# Altium project MASTER.PrjPcb (part 1 of 3)
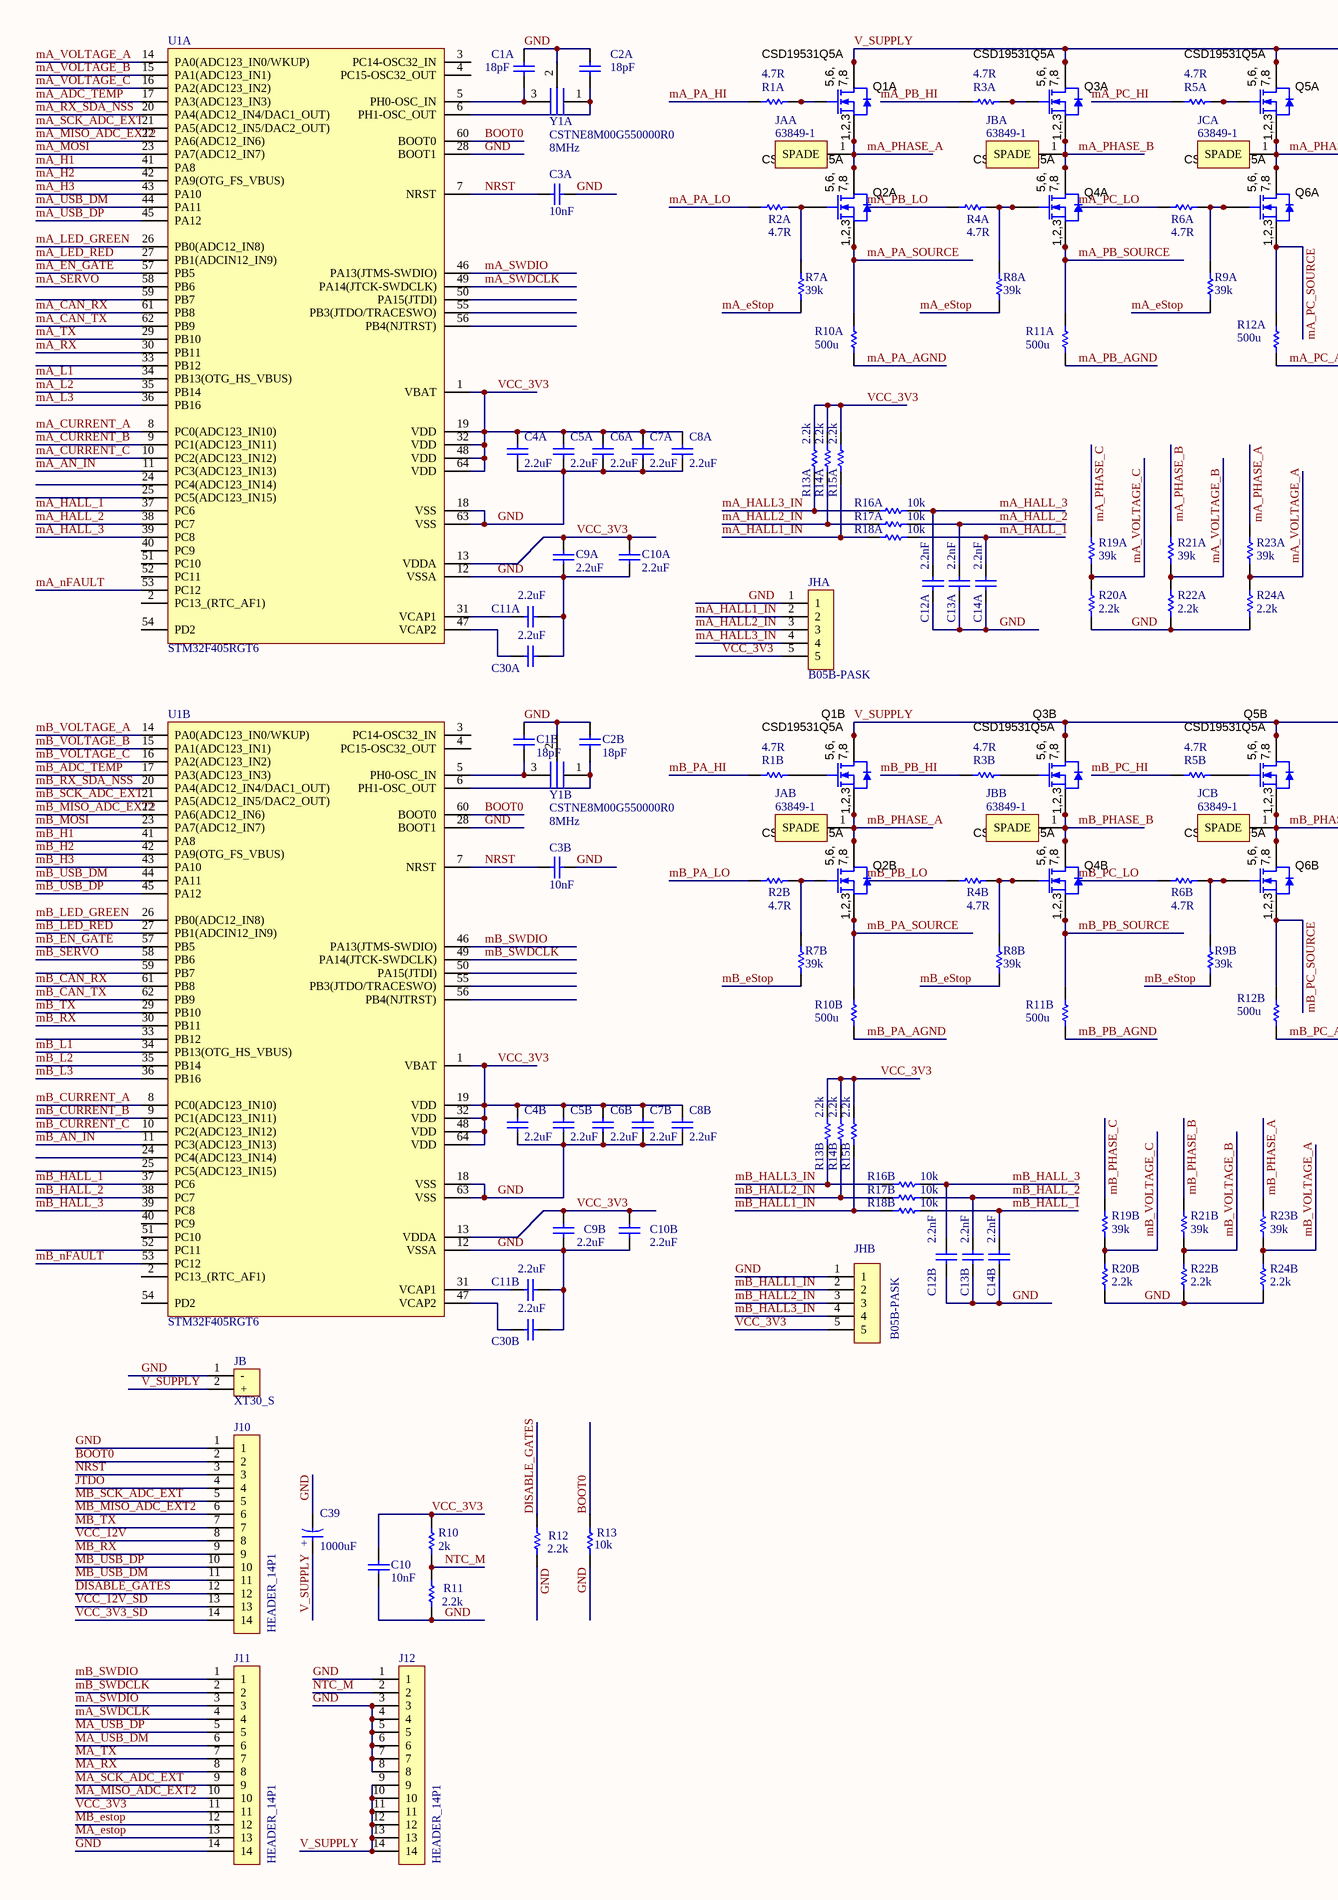
[diagram p0: Vesc.SchDoc, left]
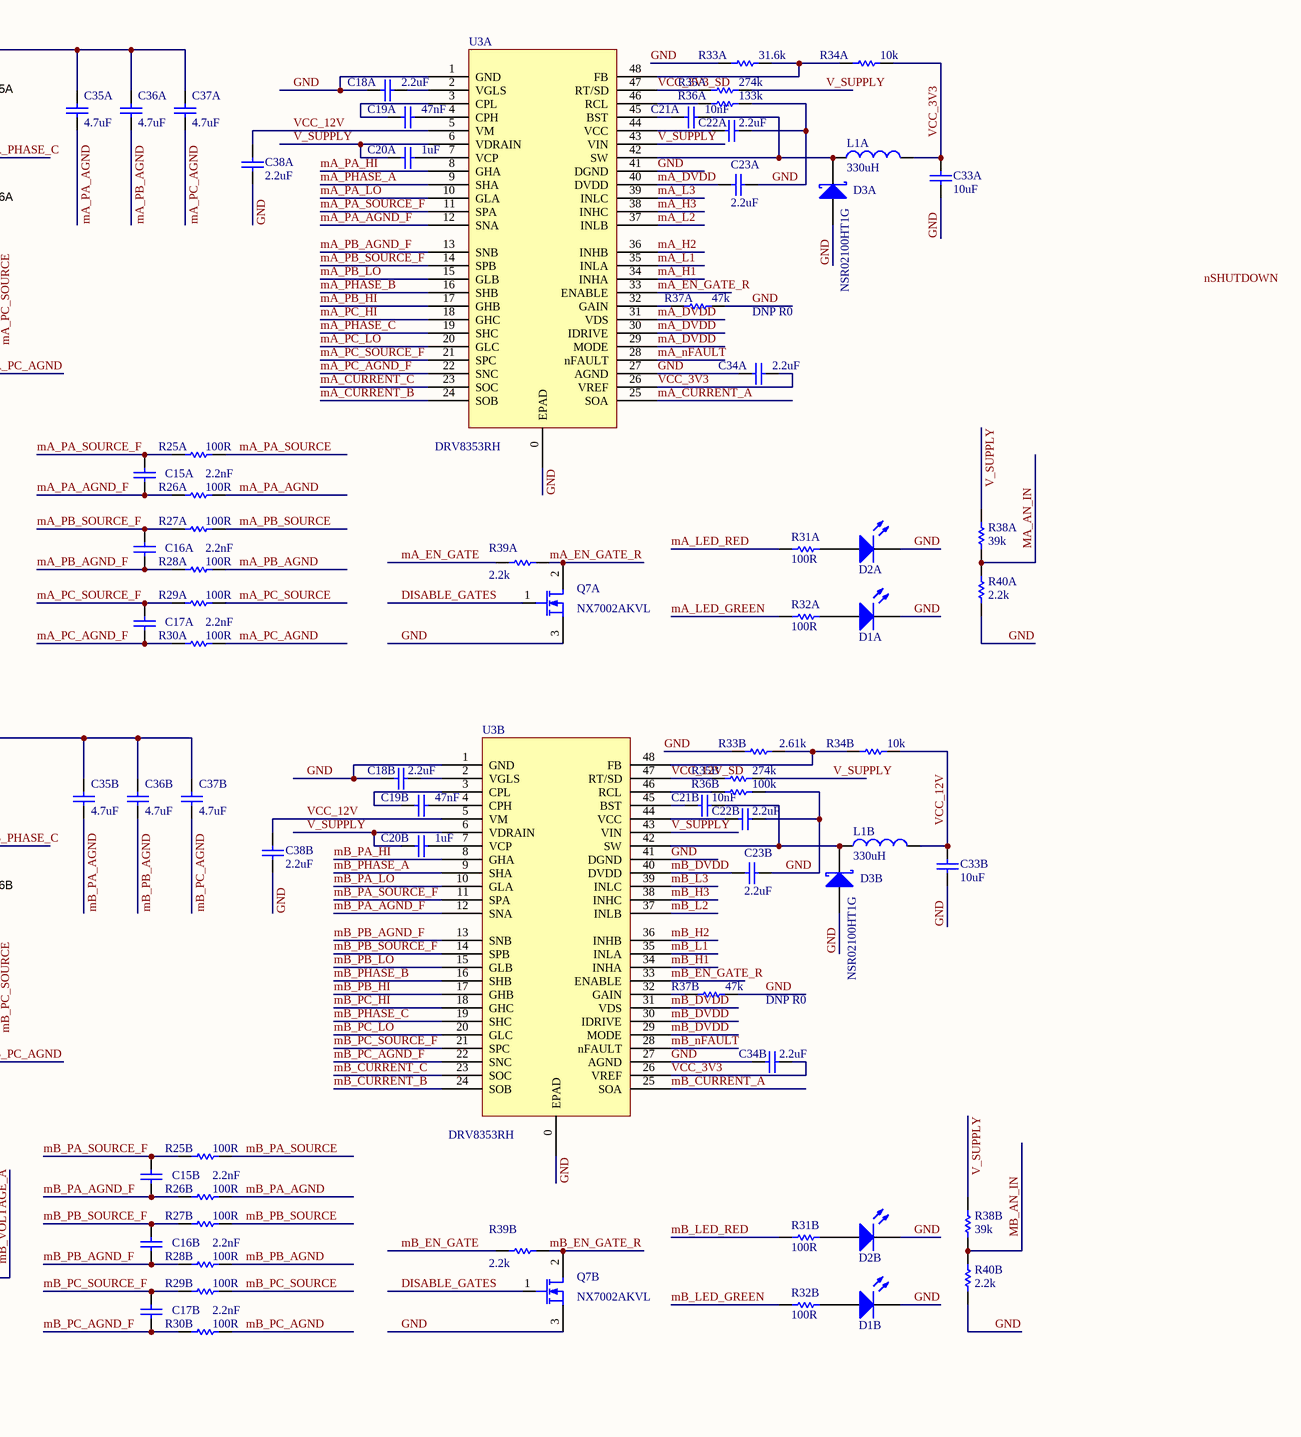
[diagram p1: Vesc.SchDoc, right]
5 sheets, 615 parts. Net scope: global (net labels, ports and power ports of the same name join across sheets).
Sheets:
  Vesc.SchDoc
  TestPanel.SchDoc
  Vesc_Simple_2.SchDoc
  OverDrive.SchDoc
  CIV.SchDoc

## Sheet Vesc.SchDoc
size C

### Parts
(Parts that share a designator on the sheet are numbered #1, #2 ... from top to bottom, then left to right.)
C1A  value 18pF  [CAP 0402]  (hidden comment: GCM1555C1H180JA16D)
C1B#1  value 18pF  [CAP 0402]  (hidden comment: GCM1555C1H180JA16D)
C2A  value 18pF  [CAP 0402]  (hidden comment: GCM1555C1H180JA16D)
C2B#1  value 18pF  [CAP 0402]  (hidden comment: GCM1555C1H180JA16D)
C3A#1  value 10nF  [CAP 0402]  (hidden comment: GCM155R71E103JA37D)
C3B#1  value 10nF  [CAP 0402]  (hidden comment: GCM155R71E103JA37D)
C4A#1  value 2.2uF  [CAP 0402]  (hidden comment: GRM155C81C225ME15D)
C4B#1  value 2.2uF  [CAP 0402]  (hidden comment: GRM155C81C225ME15D)
C5A#1  value 2.2uF  [CAP 0402]  (hidden comment: GRM155C81C225ME15D)
C5B#1  value 2.2uF  [CAP 0402]  (hidden comment: GRM155C81C225ME15D)
C6A#1  value 2.2uF  [CAP 0402]  (hidden comment: GRM155C81C225ME15D)
C6B#1  value 2.2uF  [CAP 0402]  (hidden comment: GRM155C81C225ME15D)
C7A#1  value 2.2uF  [CAP 0402]  (hidden comment: GRM155C81C225ME15D)
C7B#1  value 2.2uF  [CAP 0402]  (hidden comment: GRM155C81C225ME15D)
C8A#1  value 2.2uF  [CAP 0402]  (hidden comment: GRM155C81C225ME15D)
C8B#1  value 2.2uF  [CAP 0402]  (hidden comment: GRM155C81C225ME15D)
C9A#1  value 2.2uF  [CAP 0402]  (hidden comment: GRM155C81C225ME15D)
C9B#1  value 2.2uF  [CAP 0402]  (hidden comment: GRM155C81C225ME15D)
C10#1  value 10nF  [CAP 0402]  (hidden comment: GCM155R71E103JA37D)
C10A#1  value 2.2uF  [CAP 0402]  (hidden comment: GRM155C81C225ME15D)
C10B#1  value 2.2uF  [CAP 0402]  (hidden comment: GRM155C81C225ME15D)
C11A#1  value 2.2uF  [CAP 0402]  (hidden comment: GRM155C81C225ME15D)
C11B#1  value 2.2uF  [CAP 0402]  (hidden comment: GRM155C81C225ME15D)
C12A#1  value 2.2nF  [CAP 0402]  (hidden comment: GCM155R72A222KA37D)
C12B#1  value 2.2nF  [CAP 0402]  (hidden comment: GCM155R72A222KA37D)
C13A#1  value 2.2nF  [CAP 0402]  (hidden comment: GCM155R72A222KA37D)
C13B#1  value 2.2nF  [CAP 0402]  (hidden comment: GCM155R72A222KA37D)
C14A#1  value 2.2nF  [CAP 0402]  (hidden comment: GCM155R72A222KA37D)
C14B#1  value 2.2nF  [CAP 0402]  (hidden comment: GCM155R72A222KA37D)
C15A#1  value 2.2nF  [CAP 0402]  (hidden comment: GCM155R72A222KA37D)
C15B#1  value 2.2nF  [CAP 0402]  (hidden comment: GCM155R72A222KA37D)
C16A  value 2.2nF  [CAP 0402]  (hidden comment: GCM155R72A222KA37D)
C16B  value 2.2nF  [CAP 0402]  (hidden comment: GCM155R72A222KA37D)
C17A#1  value 2.2nF  [CAP 0402]  (hidden comment: GCM155R72A222KA37D)
C17B#1  value 2.2nF  [CAP 0402]  (hidden comment: GCM155R72A222KA37D)
C18A#1  value 2.2uF  [CAP 0402]  (hidden comment: GRM155C81C225ME15D)
C18B#1  value 2.2uF  [CAP 0402]  (hidden comment: GRM155C81C225ME15D)
C19A#1  value 47nF  [CAP 0603]  (hidden comment: C0603C473K1RECAUTO)
C19B#1  value 47nF  [CAP 0603]  (hidden comment: C0603C473K1RECAUTO)
C20A#1  value 1uF  [CAP 1206]  (hidden comment: GRJ31CR72A105KE11L)
C20B#1  value 1uF  [CAP 1206]  (hidden comment: GRJ31CR72A105KE11L)
C21A#1  value 10nF  [CAP 0402]  (hidden comment: GCM155R71E103JA37D)
C21B#1  value 10nF  [CAP 0402]  (hidden comment: GCM155R71E103JA37D)
C22A#1  value 2.2uF  [CAP 0402]  (hidden comment: GRM155C81C225ME15D)
C22B#1  value 2.2uF  [CAP 0402]  (hidden comment: GRM155C81C225ME15D)
C23A#1  value 2.2uF  [CAP 0402]  (hidden comment: GRM155C81C225ME15D)
C23B#1  value 2.2uF  [CAP 0402]  (hidden comment: GRM155C81C225ME15D)
C30A#1  value 2.2uF  [CAP 0402]  (hidden comment: GRM155C81C225ME15D)
C30B#1  value 2.2uF  [CAP 0402]  (hidden comment: GRM155C81C225ME15D)
C33A#1  value 10uF  [CAP 1206]  (hidden comment: TMK316AB7106KL-T)
C33B#1  value 10uF  [CAP 1206]  (hidden comment: TMK316AB7106KL-T)
C34A#1  value 2.2uF  [CAP 0402]  (hidden comment: GRM155C81C225ME15D)
C34B#1  value 2.2uF  [CAP 0402]  (hidden comment: GRM155C81C225ME15D)
C35A#1  value 4.7uF  [CAP 1210]  (hidden comment: CGA6M3X7S2A475M200AB)
C35B  value 4.7uF  [CAP 1210]  (hidden comment: CGA6M3X7S2A475M200AB)
C36A#1  value 4.7uF  [CAP 1210]  (hidden comment: CGA6M3X7S2A475M200AB)
C36B  value 4.7uF  [CAP 1210]  (hidden comment: CGA6M3X7S2A475M200AB)
C37A#1  value 4.7uF  [CAP 1210]  (hidden comment: CGA6M3X7S2A475M200AB)
C37B  value 4.7uF  [CAP 1210]  (hidden comment: CGA6M3X7S2A475M200AB)
C38A#1  value 2.2uF  [CAP 0402]  (hidden comment: GRM155C81C225ME15D)
C38B#1  value 2.2uF  [CAP 0402]  (hidden comment: GRM155C81C225ME15D)
C39#1  value 1000uF  [CAP 7.5mm Bent]  (hidden comment: 108CKS100MRY)
D1A#1  LTST-C190KRKT  [LED 0603]  (value not drawn)
D1B#1  LTST-C190KRKT  [LED 0603]  (value not drawn)
D2A  LTST-C190KRKT  [LED 0603]  (value not drawn)
D2B  LTST-C190KRKT  [LED 0603]  (value not drawn)
D3A#1  NSR02100HT1G  [SOD-323/SC76]
D3B#1  NSR02100HT1G  [SOD-323/SC76]
J10#1  HEADER_14P1  [HEADER_14P1_FEMALE_TH]
J11#1  HEADER_14P1  [HEADER_14P1_FEMALE_TH]
J12#1  HEADER_14P1  [HEADER_14P1_FEMALE_TH]
JAA#1  63849-1  [63849-1]
JAB#1  63849-1  [63849-1]
JB#1  XT30_S  [XT30 SOCKET]
JBA#1  63849-1  [63849-1]
JBB#1  63849-1  [63849-1]
JCA#1  63849-1  [63849-1]
JCB#1  63849-1  [63849-1]
JHA#1  B05B-PASK  [B05B-PASK]
JHB#1  B05B-PASK  [B05B-PASK]
L1A#1  value 330uH  [SDE0805A]  (hidden comment: SDE0805A-331K)
L1B#1  value 330uH  [SDE0805A]  (hidden comment: SDE0805A-331K)
Q1A#1  CSD19531Q5A  [VSONP-8]
Q1B#1  CSD19531Q5A  [VSONP-8]
Q2A#1  CSD19531Q5A  [VSONP-8]
Q2B#1  CSD19531Q5A  [VSONP-8]
Q3A#1  CSD19531Q5A  [VSONP-8]
Q3B#1  CSD19531Q5A  [VSONP-8]
Q4A#1  CSD19531Q5A  [VSONP-8]
Q4B#1  CSD19531Q5A  [VSONP-8]
Q5A#1  CSD19531Q5A  [VSONP-8]
Q5B#1  CSD19531Q5A  [VSONP-8]
Q6A#1  CSD19531Q5A  [VSONP-8]
Q6B#1  CSD19531Q5A  [VSONP-8]
Q7A  NX7002AKVL  [SOT-23-3]
Q7B  NX7002AKVL  [SOT-23-3]
R1A#1  value 4.7R  [RES 0402]  (hidden comment: ERJ-PA3J4R7V)
R1B#1  value 4.7R  [RES 0402]  (hidden comment: ERJ-PA3J4R7V)
R2A#1  value 4.7R  [RES 0402]  (hidden comment: ERJ-PA3J4R7V)
R2B#1  value 4.7R  [RES 0402]  (hidden comment: ERJ-PA3J4R7V)
R3A#1  value 4.7R  [RES 0402]  (hidden comment: ERJ-PA3J4R7V)
R3B#1  value 4.7R  [RES 0402]  (hidden comment: ERJ-PA3J4R7V)
R4A#1  value 4.7R  [RES 0402]  (hidden comment: ERJ-PA3J4R7V)
R4B#1  value 4.7R  [RES 0402]  (hidden comment: ERJ-PA3J4R7V)
R5A#1  value 4.7R  [RES 0402]  (hidden comment: ERJ-PA3J4R7V)
R5B#1  value 4.7R  [RES 0402]  (hidden comment: ERJ-PA3J4R7V)
R6A#1  value 4.7R  [RES 0402]  (hidden comment: ERJ-PA3J4R7V)
R6B#1  value 4.7R  [RES 0402]  (hidden comment: ERJ-PA3J4R7V)
R7A  value 39k  [RES 0402]  (hidden comment: ERJ-2RKF3902X)
R7B#1  value 39k  [RES 0402]  (hidden comment: ERJ-2RKF3902X)
R8A  value 39k  [RES 0402]  (hidden comment: ERJ-2RKF3902X)
R8B#1  value 39k  [RES 0402]  (hidden comment: ERJ-2RKF3902X)
R9A  value 39k  [RES 0402]  (hidden comment: ERJ-2RKF3902X)
R9B#1  value 39k  [RES 0402]  (hidden comment: ERJ-2RKF3902X)
R10#1  value 2k  [RES 0402]  (hidden comment: ERT-J0EG202GM)
R10A#1  value 500u  [RES 2512]  (hidden comment: WSLF2512L5000FEA)
R10B#1  value 500u  [RES 2512]  (hidden comment: WSLF2512L5000FEA)
R11#1  value 2.2k  [RES 0402]  (hidden comment: ERJ-2RKF2201X)
R11A#1  value 500u  [RES 2512]  (hidden comment: WSLF2512L5000FEA)
R11B  value 500u  [RES 2512]  (hidden comment: WSLF2512L5000FEA)
R12  value 2.2k  [RES 0402]  (hidden comment: ERJ-2RKF2201X)
R12A#1  value 500u  [RES 2512]  (hidden comment: WSLF2512L5000FEA)
R12B#1  value 500u  [RES 2512]  (hidden comment: WSLF2512L5000FEA)
R13#1  value 10k  [RES 0402]  (hidden comment: ERJ-2RKF1002X)
R13A#1  value 2.2k  [RES 0402]  (hidden comment: ERJ-2RKF2201X)
R13B#1  value 2.2k  [RES 0402]  (hidden comment: ERJ-2RKF2201X)
R14A#1  value 2.2k  [RES 0402]  (hidden comment: ERJ-2RKF2201X)
R14B#1  value 2.2k  [RES 0402]  (hidden comment: ERJ-2RKF2201X)
R15A#1  value 2.2k  [RES 0402]  (hidden comment: ERJ-2RKF2201X)
R15B#1  value 2.2k  [RES 0402]  (hidden comment: ERJ-2RKF2201X)
R16A#1  value 10k  [RES 0402]  (hidden comment: ERJ-2RKF1002X)
R16B#1  value 10k  [RES 0402]  (hidden comment: ERJ-2RKF1002X)
R17A#1  value 10k  [RES 0402]  (hidden comment: ERJ-2RKF1002X)
R17B#1  value 10k  [RES 0402]  (hidden comment: ERJ-2RKF1002X)
R18A#1  value 10k  [RES 0402]  (hidden comment: ERJ-2RKF1002X)
R18B#1  value 10k  [RES 0402]  (hidden comment: ERJ-2RKF1002X)
R19A#1  value 39k  [RES 0402]  (hidden comment: ERJ-2RKF3902X)
R19B#1  value 39k  [RES 0402]  (hidden comment: ERJ-2RKF3902X)
R20A#1  value 2.2k  [RES 0402]  (hidden comment: ERJ-2RKF2201X)
R20B#1  value 2.2k  [RES 0402]  (hidden comment: ERJ-2RKF2201X)
R21A#1  value 39k  [RES 0402]  (hidden comment: ERJ-2RKF3902X)
R21B#1  value 39k  [RES 0402]  (hidden comment: ERJ-2RKF3902X)
R22A#1  value 2.2k  [RES 0402]  (hidden comment: ERJ-2RKF2201X)
R22B#1  value 2.2k  [RES 0402]  (hidden comment: ERJ-2RKF2201X)
R23A#1  value 39k  [RES 0402]  (hidden comment: ERJ-2RKF3902X)
R23B#1  value 39k  [RES 0402]  (hidden comment: ERJ-2RKF3902X)
R24A#1  value 2.2k  [RES 0402]  (hidden comment: ERJ-2RKF2201X)
R24B#1  value 2.2k  [RES 0402]  (hidden comment: ERJ-2RKF2201X)
R25A#1  value 100R  [RES 0402]  (hidden comment: ERJ-2RKF1000X)
R25B#1  value 100R  [RES 0402]  (hidden comment: ERJ-2RKF1000X)
R26A#1  value 100R  [RES 0402]  (hidden comment: ERJ-2RKF1000X)
R26B#1  value 100R  [RES 0402]  (hidden comment: ERJ-2RKF1000X)
R27A  value 100R  [RES 0402]  (hidden comment: ERJ-2RKF1000X)
R27B  value 100R  [RES 0402]  (hidden comment: ERJ-2RKF1000X)
R28A  value 100R  [RES 0402]  (hidden comment: ERJ-2RKF1000X)
R28B  value 100R  [RES 0402]  (hidden comment: ERJ-2RKF1000X)
R29A#1  value 100R  [RES 0402]  (hidden comment: ERJ-2RKF1000X)
R29B#1  value 100R  [RES 0402]  (hidden comment: ERJ-2RKF1000X)
R30A#1  value 100R  [RES 0402]  (hidden comment: ERJ-2RKF1000X)
R30B#1  value 100R  [RES 0402]  (hidden comment: ERJ-2RKF1000X)
R31A  value 100R  [RES 0402]  (hidden comment: ERJ-2RKF1000X)
R31B  value 100R  [RES 0402]  (hidden comment: ERJ-2RKF1000X)
R32A#1  value 100R  [RES 0402]  (hidden comment: ERJ-2RKF1000X)
R32B#1  value 100R  [RES 0402]  (hidden comment: ERJ-2RKF1000X)
R33A#1  value 31.6k  [RES 0402]  (hidden comment: ERJ-2RKF3162X)
R33B#1  value 2.61k  [RES 0402]  (hidden comment: ERJ-2RKF2611X)
R34A#1  value 10k  [RES 0402]  (hidden comment: ERJ-2RKF1002X)
R34B#1  value 10k  [RES 0402]  (hidden comment: ERJ-2RKF1002X)
R35A#1  value 274k  [RES 0402]  (hidden comment: ERJ-2RKF2743X)
R35B#1  value 274k  [RES 0402]  (hidden comment: ERJ-2RKF2743X)
R36A#1  value 133k  [RES 0402]  (hidden comment: ERJ-2RKF1333X)
R36B#1  value 100k  [RES 0402]  (hidden comment: ERJ-2RKF1003X)
R37A  value 47k  [RES 0402]  (hidden comment: ERJ-2RKF4702X)
R37B#1  value 47k  [RES 0402]  (hidden comment: ERJ-2RKF4702X)
R38A#1  value 39k  [RES 0402]  (hidden comment: ERJ-2RKF3902X)
R38B#1  value 39k  [RES 0402]  (hidden comment: ERJ-2RKF3902X)
R39A  value 2.2k  [RES 0402]  (hidden comment: ERJ-2RKF2201X)
R39B  value 2.2k  [RES 0402]  (hidden comment: ERJ-2RKF2201X)
R40A#1  value 2.2k  [RES 0402]  (hidden comment: ERJ-2RKF2201X)
R40B#1  value 2.2k  [RES 0402]  (hidden comment: ERJ-2RKF2201X)
U1A#1  STM32F405RGT6  [QFP-64 - P0.5MM]
U1B#1  STM32F405RGT6  [QFP-64 - P0.5MM]
U3A#1  DRV8353RH  [QFN-48 - P0.5MM]
U3B#1  DRV8353RH  [QFN-48 - P0.5MM]
Y1A#1  CSTNE8M00G550000R0  value 8MHz  [MuRata CSTN]
Y1B#1  CSTNE8M00G550000R0  value 8MHz  [MuRata CSTN]

### Nets
BOOT0: J10#1.2 R13#1.2 U1A#1.60(BOOT0) U1B#1.60(BOOT0)
DISABLE_GATES: J10#1.12 Q7A.1(G) Q7B.1(G) R12.2
GND: C1A.2 C1B#1.2 C2A.2 C2B#1.2 C3A#1.2 C3B#1.2 C4A#1.2 C4B#1.2 C5A#1.2 C5B#1.2 C6A#1.2 C6B#1.2 C7A#1.2 C7B#1.2 C8A#1.2 C8B#1.2 C9A#1.2 C9B#1.2 C10#1.1 C10A#1.2 C10B#1.2 C11A#1.2 C11B#1.2 C12A#1.1 C12B#1.1 C13A#1.1 C13B#1.1 C14A#1.1 C14B#1.1 C18A#1.2 C18B#1.2 C22A#1.1 C22B#1.1 C23A#1.1 C23B#1.1 C30A#1.2 C30B#1.2 C33A#1.2 C33B#1.2 C34A#1.2 C34B#1.2 C38A#1.2 C38B#1.2 C39#1.1 D1A#1.2(K) D1B#1.2(K) D2A.2(K) D2B.2(K) D3A#1.1(A) D3B#1.1(A) J10#1.1 J11#1.14 J12#1.1 J12#1.3 J12#1.4 J12#1.5 J12#1.6 J12#1.7 J12#1.8 JB#1.1(-) JHA#1.1 JHB#1.1 Q7A.3(D) Q7B.3(D) R11#1.1 R12.1 R13#1.1 R20A#1.1 R20B#1.1 R22A#1.1 R22B#1.1 R24A#1.1 R24B#1.1 R33A#1.1 R33B#1.1 R36A#1.2 R36B#1.2 R37A.2 R37B#1.2 R40A#1.1 R40B#1.1 U1A#1.12(VSSA) U1A#1.18(VSS) U1A#1.28(BOOT1) U1A#1.63(VSS) U1B#1.12(VSSA) U1B#1.18(VSS) U1B#1.28(BOOT1) U1B#1.63(VSS) U3A#1.0(EPAD) U3A#1.1(GND) U3A#1.27(AGND) U3A#1.41(DGND) U3B#1.0(EPAD) U3B#1.1(GND) U3B#1.27(AGND) U3B#1.41(DGND) Y1A#1.2 Y1B#1.2
JTDO: J10#1.4
mA_ADC_TEMP: U1A#1.17(PA3(ADC123_IN3))
mA_AN_IN: R38A#1.1 R40A#1.2 U1A#1.11(PC3(ADC123_IN13))
mA_CAN_RX: U1A#1.61(PB8)
mA_CAN_TX: U1A#1.62(PB9)
mA_CURRENT_A: U1A#1.8(PC0(ADC123_IN10)) U3A#1.25(SOA)
mA_CURRENT_B: U1A#1.9(PC1(ADC123_IN11)) U3A#1.24(SOB)
mA_CURRENT_C: U1A#1.10(PC2(ADC123_IN12)) U3A#1.23(SOC)
mA_DVDD: C23A#1.2 U3A#1.29(MODE) U3A#1.30(IDRIVE) U3A#1.31(VDS) U3A#1.40(DVDD)
mA_EN_GATE: R39A.2 U1A#1.57(PB5)
mA_EN_GATE_R: Q7A.2(S) R39A.1 U3A#1.33(ENABLE)
mA_eStop: J11#1.13 R7A.1 R8A.1 R9A.1
mA_H1: U1A#1.41(PA8) U3A#1.34(INHA)
mA_H2: U1A#1.42(PA9(OTG_FS_VBUS)) U3A#1.36(INHB)
mA_H3: U1A#1.43(PA10) U3A#1.38(INHC)
mA_HALL1_IN: JHA#1.2 R15A#1.1 R18A#1.1
mA_HALL2_IN: JHA#1.3 R14A#1.1 R17A#1.1
mA_HALL3_IN: JHA#1.4 R13A#1.1 R16A#1.1
mA_HALL_1: C14A#1.2 R18A#1.2 U1A#1.37(PC6)
mA_HALL_2: C13A#1.2 R17A#1.2 U1A#1.38(PC7)
mA_HALL_3: C12A#1.2 R16A#1.2 U1A#1.39(PC8)
mA_L1: U1A#1.34(PB13(OTG_HS_VBUS)) U3A#1.35(INLA)
mA_L2: U1A#1.35(PB14) U3A#1.37(INLB)
mA_L3: U1A#1.36(PB16) U3A#1.39(INLC)
mA_LED_GREEN: R32A#1.2 U1A#1.26(PB0(ADC12_IN8))
mA_LED_RED: R31A.2 U1A#1.27(PB1(ADCIN12_IN9))
mA_MISO_ADC_EXT2: J11#1.10 U1A#1.22(PA6(ADC12_IN6))
mA_MOSI: U1A#1.23(PA7(ADC12_IN7))
mA_nFAULT: U1A#1.53(PC12) U3A#1.28(nFAULT)
mA_PA_AGND: C35A#1.1 R10A#1.1 R26A#1.2
mA_PA_AGND_F: C15A#1.1 R26A#1.1 U3A#1.12(SNA)
mA_PA_HI: R1A#1.1 U3A#1.8(GHA)
mA_PA_LO: R2A#1.1 U3A#1.10(GLA)
mA_PA_SOURCE: Q2A#1.1(S) Q2A#1.2(S) Q2A#1.3(S) Q2B#1.1(S) Q2B#1.2(S) Q2B#1.3(S) R10A#1.2 R10B#1.2 R25A#1.2 R25B#1.2  [also labelled mB_PA_SOURCE]
mA_PA_SOURCE_F: C15A#1.2 R25A#1.1 U3A#1.11(SPA)
mA_PB_AGND: C36A#1.1 R11A#1.1 R28A.2
mA_PB_AGND_F: C16A.1 R28A.1 U3A#1.13(SNB)
mA_PB_HI: R3A#1.1 U3A#1.17(GHB)
mA_PB_LO: R4A#1.1 U3A#1.15(GLB)
mA_PB_SOURCE: Q4A#1.1(S) Q4A#1.2(S) Q4A#1.3(S) R11A#1.2 R27A.2
mA_PB_SOURCE_F: C16A.2 R27A.1 U3A#1.14(SPB)
mA_PC_AGND: C37A#1.1 R12A#1.1 R30A#1.2
mA_PC_AGND_F: C17A#1.1 R30A#1.1 U3A#1.22(SNC)
mA_PC_HI: R5A#1.1 U3A#1.18(GHC)
mA_PC_LO: R6A#1.1 U3A#1.20(GLC)
mA_PC_SOURCE: Q6A#1.1(S) Q6A#1.2(S) Q6A#1.3(S) R12A#1.2 R29A#1.2
mA_PC_SOURCE_F: C17A#1.2 R29A#1.1 U3A#1.21(SPC)
mA_PHASE_A: JAA#1.1(SPADE) Q1A#1.1(S) Q1A#1.2(S) Q1A#1.3(S) Q2A#1.5(D) Q2A#1.6(D) Q2A#1.7(D) Q2A#1.8(D) Q2A#1.9(D) R23A#1.2 U3A#1.9(SHA)
mA_PHASE_B: JBA#1.1(SPADE) Q3A#1.1(S) Q3A#1.2(S) Q3A#1.3(S) Q4A#1.5(D) Q4A#1.6(D) Q4A#1.7(D) Q4A#1.8(D) Q4A#1.9(D) R21A#1.2 U3A#1.16(SHB)
mA_PHASE_C: JCA#1.1(SPADE) Q5A#1.1(S) Q5A#1.2(S) Q5A#1.3(S) Q6A#1.5(D) Q6A#1.6(D) Q6A#1.7(D) Q6A#1.8(D) Q6A#1.9(D) R19A#1.2 U3A#1.19(SHC)
mA_RX: J11#1.8 U1A#1.30(PB11)
mA_RX_SDA_NSS: U1A#1.20(PA4(ADC12_IN4/DAC1_OUT))
mA_SCK_ADC_EXT: J11#1.9 U1A#1.21(PA5(ADC12_IN5/DAC2_OUT))
mA_SERVO: U1A#1.58(PB6)
mA_SWDCLK: J11#1.4 U1A#1.49(PA14(JTCK-SWDCLK))
mA_SWDIO: J11#1.3 U1A#1.46(PA13(JTMS-SWDIO))
mA_TX: J11#1.7 U1A#1.29(PB10)
mA_USB_DM: J11#1.6 U1A#1.44(PA11)
mA_USB_DP: J11#1.5 U1A#1.45(PA12)
mA_VOLTAGE_A: R23A#1.1 R24A#1.2 U1A#1.14(PA0(ADC123_IN0/WKUP))
mA_VOLTAGE_B: R21A#1.1 R22A#1.2 U1A#1.15(PA1(ADC123_IN1))
mA_VOLTAGE_C: R19A#1.1 R20A#1.2 U1A#1.16(PA2(ADC123_IN2))
mB_ADC_TEMP: U1B#1.17(PA3(ADC123_IN3))
mB_AN_IN: R38B#1.1 R40B#1.2 U1B#1.11(PC3(ADC123_IN13))
mB_CAN_RX: U1B#1.61(PB8)
mB_CAN_TX: U1B#1.62(PB9)
mB_CURRENT_A: U1B#1.8(PC0(ADC123_IN10)) U3B#1.25(SOA)
mB_CURRENT_B: U1B#1.9(PC1(ADC123_IN11)) U3B#1.24(SOB)
mB_CURRENT_C: U1B#1.10(PC2(ADC123_IN12)) U3B#1.23(SOC)
mB_DVDD: C23B#1.2 U3B#1.29(MODE) U3B#1.30(IDRIVE) U3B#1.31(VDS) U3B#1.40(DVDD)
mB_EN_GATE: R39B.2 U1B#1.57(PB5)
mB_EN_GATE_R: Q7B.2(S) R39B.1 U3B#1.33(ENABLE)
mB_eStop: J11#1.12 R7B#1.1 R8B#1.1 R9B#1.1
mB_H1: U1B#1.41(PA8) U3B#1.34(INHA)
mB_H2: U1B#1.42(PA9(OTG_FS_VBUS)) U3B#1.36(INHB)
mB_H3: U1B#1.43(PA10) U3B#1.38(INHC)
mB_HALL1_IN: JHB#1.2 R15B#1.1 R18B#1.1
mB_HALL2_IN: JHB#1.3 R14B#1.1 R17B#1.1
mB_HALL3_IN: JHB#1.4 R13B#1.1 R16B#1.1
mB_HALL_1: C14B#1.2 R18B#1.2 U1B#1.37(PC6)
mB_HALL_2: C13B#1.2 R17B#1.2 U1B#1.38(PC7)
mB_HALL_3: C12B#1.2 R16B#1.2 U1B#1.39(PC8)
mB_L1: U1B#1.34(PB13(OTG_HS_VBUS)) U3B#1.35(INLA)
mB_L2: U1B#1.35(PB14) U3B#1.37(INLB)
mB_L3: U1B#1.36(PB16) U3B#1.39(INLC)
mB_LED_GREEN: R32B#1.2 U1B#1.26(PB0(ADC12_IN8))
mB_LED_RED: R31B.2 U1B#1.27(PB1(ADCIN12_IN9))
mB_MISO_ADC_EXT2: J10#1.6 U1B#1.22(PA6(ADC12_IN6))
mB_MOSI: U1B#1.23(PA7(ADC12_IN7))
mB_nFAULT: U1B#1.53(PC12) U3B#1.28(nFAULT)
mB_PA_AGND: C35B.1 R10B#1.1 R26B#1.2
mB_PA_AGND_F: C15B#1.1 R26B#1.1 U3B#1.12(SNA)
mB_PA_HI: R1B#1.1 U3B#1.8(GHA)
mB_PA_LO: R2B#1.1 U3B#1.10(GLA)
mB_PA_SOURCE_F: C15B#1.2 R25B#1.1 U3B#1.11(SPA)
mB_PB_AGND: C36B.1 Q4B#1.1(S) Q4B#1.2(S) Q4B#1.3(S) R11B.1 R11B.2 R27B.2 R28B.2  [also labelled mB_PB_SOURCE]
mB_PB_AGND_F: C16B.1 R28B.1 U3B#1.13(SNB)
mB_PB_HI: R3B#1.1 U3B#1.17(GHB)
mB_PB_LO: R4B#1.1 U3B#1.15(GLB)
mB_PB_SOURCE_F: C16B.2 R27B.1 U3B#1.14(SPB)
mB_PC_AGND: C37B.1 R12B#1.1 R30B#1.2
mB_PC_AGND_F: C17B#1.1 R30B#1.1 U3B#1.22(SNC)
mB_PC_HI: R5B#1.1 U3B#1.18(GHC)
mB_PC_LO: R6B#1.1 U3B#1.20(GLC)
mB_PC_SOURCE: Q6B#1.1(S) Q6B#1.2(S) Q6B#1.3(S) R12B#1.2 R29B#1.2
mB_PC_SOURCE_F: C17B#1.2 R29B#1.1 U3B#1.21(SPC)
mB_PHASE_A: JAB#1.1(SPADE) Q1B#1.1(S) Q1B#1.2(S) Q1B#1.3(S) Q2B#1.5(D) Q2B#1.6(D) Q2B#1.7(D) Q2B#1.8(D) Q2B#1.9(D) R23B#1.2 U3B#1.9(SHA)
mB_PHASE_B: JBB#1.1(SPADE) Q3B#1.1(S) Q3B#1.2(S) Q3B#1.3(S) Q4B#1.5(D) Q4B#1.6(D) Q4B#1.7(D) Q4B#1.8(D) Q4B#1.9(D) R21B#1.2 U3B#1.16(SHB)
mB_PHASE_C: JCB#1.1(SPADE) Q5B#1.1(S) Q5B#1.2(S) Q5B#1.3(S) Q6B#1.5(D) Q6B#1.6(D) Q6B#1.7(D) Q6B#1.8(D) Q6B#1.9(D) R19B#1.2 U3B#1.19(SHC)
mB_RX: J10#1.9 U1B#1.30(PB11)
mB_RX_SDA_NSS: U1B#1.20(PA4(ADC12_IN4/DAC1_OUT))
mB_SCK_ADC_EXT: J10#1.5 U1B#1.21(PA5(ADC12_IN5/DAC2_OUT))
mB_SERVO: U1B#1.58(PB6)
mB_SWDCLK: J11#1.2 U1B#1.49(PA14(JTCK-SWDCLK))
mB_SWDIO: J11#1.1 U1B#1.46(PA13(JTMS-SWDIO))
mB_TX: J10#1.7 U1B#1.29(PB10)
mB_USB_DM: J10#1.11 U1B#1.44(PA11)
mB_USB_DP: J10#1.10 U1B#1.45(PA12)
mB_VOLTAGE_A: R23B#1.1 R24B#1.2 U1B#1.14(PA0(ADC123_IN0/WKUP))
mB_VOLTAGE_B: R21B#1.1 R22B#1.2 U1B#1.15(PA1(ADC123_IN1))
mB_VOLTAGE_C: R19B#1.1 R20B#1.2 U1B#1.16(PA2(ADC123_IN2))
NRST: C3A#1.1 C3B#1.1 J10#1.3 U1A#1.7(NRST) U1B#1.7(NRST)
NTC_M: J12#1.2 R10#1.1 R11#1.2
V_SUPPLY: C20A#1.1 C20B#1.1 C35A#1.2 C35B.2 C36A#1.2 C36B.2 C37A#1.2 C37B.2 C39#1.2 J12#1.9 J12#1.10 J12#1.11 J12#1.12 J12#1.13 J12#1.14 JB#1.2(+) Q1A#1.5(D) Q1A#1.6(D) Q1A#1.7(D) Q1A#1.8(D) Q1A#1.9(D) Q1B#1.5(D) Q1B#1.6(D) Q1B#1.7(D) Q1B#1.8(D) Q1B#1.9(D) Q3A#1.5(D) Q3A#1.6(D) Q3A#1.7(D) Q3A#1.8(D) Q3A#1.9(D) Q3B#1.5(D) Q3B#1.6(D) Q3B#1.7(D) Q3B#1.8(D) Q3B#1.9(D) Q5A#1.5(D) Q5A#1.6(D) Q5A#1.7(D) Q5A#1.8(D) Q5A#1.9(D) Q5B#1.5(D) Q5B#1.6(D) Q5B#1.7(D) Q5B#1.8(D) Q5B#1.9(D) R35A#1.2 R35B#1.2 R38A#1.2 R38B#1.2 U3A#1.6(VDRAIN) U3A#1.43(VIN) U3B#1.6(VDRAIN) U3B#1.43(VIN)
VCC_3V3: C4A#1.1 C4B#1.1 C5A#1.1 C5B#1.1 C6A#1.1 C6B#1.1 C7A#1.1 C7B#1.1 C8A#1.1 C8B#1.1 C9A#1.1 C9B#1.1 C10#1.2 C10A#1.1 C10B#1.1 C33A#1.1 C34A#1.1 C34B#1.1 J11#1.11 JHA#1.5 JHB#1.5 L1A#1.2 R10#1.2 R13A#1.2 R13B#1.2 R14A#1.2 R14B#1.2 R15A#1.2 R15B#1.2 R34A#1.2 U1A#1.1(VBAT) U1A#1.13(VDDA) U1A#1.19(VDD) U1A#1.32(VDD) U1A#1.48(VDD) U1A#1.64(VDD) U1B#1.1(VBAT) U1B#1.13(VDDA) U1B#1.19(VDD) U1B#1.32(VDD) U1B#1.48(VDD) U1B#1.64(VDD) U3A#1.26(VREF) U3B#1.26(VREF)
VCC_3V3_SD: J10#1.14 R35A#1.1 U3A#1.47(RT/SD)
VCC_12V: C33B#1.1 C38A#1.1 C38B#1.1 J10#1.8 L1B#1.2 R34B#1.2 U3A#1.5(VM) U3B#1.5(VM)
VCC_12V_SD: J10#1.13 R35B#1.1 U3B#1.47(RT/SD)
NetC1A_1: C1A.1 U1A#1.5(PH0-OSC_IN) Y1A#1.3
NetC1B#1_1: C1B#1.1 U1B#1.5(PH0-OSC_IN) Y1B#1.3
NetC2A_1: C2A.1 U1A#1.6(PH1-OSC_OUT) Y1A#1.1
NetC2B#1_1: C2B#1.1 U1B#1.6(PH1-OSC_OUT) Y1B#1.1
NetC11A#1_1: C11A#1.1 U1A#1.31(VCAP1)
NetC11B#1_1: C11B#1.1 U1B#1.31(VCAP1)
NetC18A#1_1: C18A#1.1 U3A#1.2(VGLS)
NetC18B#1_1: C18B#1.1 U3B#1.2(VGLS)
NetC19A#1_1: C19A#1.1 U3A#1.3(CPL)
NetC19A#1_2: C19A#1.2 U3A#1.4(CPH)
NetC19B#1_1: C19B#1.1 U3B#1.3(CPL)
NetC19B#1_2: C19B#1.2 U3B#1.4(CPH)
NetC20A#1_2: C20A#1.2 U3A#1.7(VCP)
NetC20B#1_2: C20B#1.2 U3B#1.7(VCP)
NetC21A#1_1: C21A#1.1 U3A#1.45(BST)
NetC21A#1_2: C21A#1.2 D3A#1.2(K) L1A#1.1 U3A#1.42(SW)
NetC21B#1_1: C21B#1.1 U3B#1.45(BST)
NetC21B#1_2: C21B#1.2 D3B#1.2(K) L1B#1.1 U3B#1.42(SW)
NetC22A#1_2: C22A#1.2 U3A#1.44(VCC)
NetC22B#1_2: C22B#1.2 U3B#1.44(VCC)
NetC30A#1_1: C30A#1.1 U1A#1.47(VCAP2)
NetC30B#1_1: C30B#1.1 U1B#1.47(VCAP2)
NetD1A#1_1: D1A#1.1(A) R32A#1.1
NetD1B#1_1: D1B#1.1(A) R32B#1.1
NetD2A_1: D2A.1(A) R31A.1
NetD2B_1: D2B.1(A) R31B.1
NetQ1A#1_4: Q1A#1.4(G) R1A#1.2
NetQ1B#1_4: Q1B#1.4(G) R1B#1.2
NetQ2A#1_4: Q2A#1.4(G) R2A#1.2 R7A.2
NetQ2B#1_4: Q2B#1.4(G) R2B#1.2 R7B#1.2
NetQ3A#1_4: Q3A#1.4(G) R3A#1.2
NetQ3B#1_4: Q3B#1.4(G) R3B#1.2
NetQ4A#1_4: Q4A#1.4(G) R4A#1.2 R8A.2
NetQ4B#1_4: Q4B#1.4(G) R4B#1.2 R8B#1.2
NetQ5A#1_4: Q5A#1.4(G) R5A#1.2
NetQ5B#1_4: Q5B#1.4(G) R5B#1.2
NetQ6A#1_4: Q6A#1.4(G) R6A#1.2 R9A.2
NetQ6B#1_4: Q6B#1.4(G) R6B#1.2 R9B#1.2
NetR33A#1_2: R33A#1.2 R34A#1.1 U3A#1.48(FB)
NetR33B#1_2: R33B#1.2 R34B#1.1 U3B#1.48(FB)
NetR36A#1_1: R36A#1.1 U3A#1.46(RCL)
NetR36B#1_1: R36B#1.1 U3B#1.46(RCL)
NetR37A_1: R37A.1 U3A#1.32(GAIN)
NetR37B#1_1: R37B#1.1 U3B#1.32(GAIN)

Not connected (* = marked no-connect by the designer): U1A#1 2(PC13_(RTC_AF1)) 3(PC14-OSC32_IN) 4(PC15-OSC32_OUT) 24(PC4(ADC123_IN14)) 25(PC5(ADC123_IN15)) 33(PB12) 40(PC9) 50(PA15(JTDI)) 51(PC10) 52(PC11) 54(PD2) 55(PB3(JTDO/TRACESWO)) 56(PB4(NJTRST)) 59(PB7); U1B#1 2(PC13_(RTC_AF1)) 3(PC14-OSC32_IN) 4(PC15-OSC32_OUT) 24(PC4(ADC123_IN14)) 25(PC5(ADC123_IN15)) 33(PB12) 40(PC9) 50(PA15(JTDI)) 51(PC10) 52(PC11) 54(PD2) 55(PB3(JTDO/TRACESWO)) 56(PB4(NJTRST)) 59(PB7)

### Notes on the sheet
- DNP R0
- Labels drawn without touching a wire or pin: nSHUTDOWN
- (in symbol 108CKS100MRY) +
- (in symbol CSD19531Q5A) 5,6,; 7,8; 1,2,3

### Library data of the parts
C1A C1B#1 C2A C2B#1 = GCM1555C1H180JA16D: CAP 0402 18pF 50V (NP0 Dielectric); WVDC: 50
C3A#1 C3B#1 C10#1 C21A#1 C21B#1 = GCM155R71E103JA37D: CAP 0402 10nF 25V; WVDC: 25
C4A#1 C4B#1 C5A#1 C5B#1 C6A#1 C6B#1 C7A#1 C7B#1 C8A#1 C8B#1 C9A#1 C9B#1 C10A#1 C10B#1 C11A#1 C11B#1 C18A#1 C18B#1 C22A#1 C22B#1 C23A#1 C23B#1 C30A#1 C30B#1 C34A#1 C34B#1 C38A#1 C38B#1 = GRM155C81C225ME15D: CAP 0402 2.2uF 16V; WVDC: 16
C12A#1 C12B#1 C13A#1 C13B#1 C14A#1 C14B#1 C15A#1 C15B#1 C16A C16B C17A#1 C17B#1 = GCM155R72A222KA37D: CAP 0402 2.2nF 100V (X7R DIELECTRIC); WVDC: 100
C19A#1 C19B#1 = C0603C473K1RECAUTO: CAP 0603 47nF 100V (X7R DIELECTRIC); WVDC: 100
C20A#1 C20B#1 = GRJ31CR72A105KE11L: CAP 1206 1uF 100V; WVDC: 100
C33A#1 C33B#1 = TMK316AB7106KL-T: CAP 1206 10uF 25V; WVDC: 25
C35A#1 C35B C36A#1 C36B C37A#1 C37B = CGA6M3X7S2A475M200AB: CAP 1206 4.7uF 100V; WVDC: 100
C39#1 = 108CKS100MRY: CAP 7.5mm Radial 1000uF 100V; WVDC: 100
D1A#1 D1B#1 D2A D2B = LTST-C190KRKT: RED LED
D3A#1 D3B#1 = NSR02100HT1G: Schottky Diodes & Rectifiers 100V; Vrrm: 100; If: 200mA
J10#1 J11#1 J12#1 = HEADER_14P1: 2.54mm Header 14 Pin 1 Row
JAA#1 JAB#1 JBA#1 JBB#1 JCA#1 JCB#1 = 63849-1: SPADE CONNECTOR BOARD MOUNT
JB#1 = XT30_S: XT30 SOCKET
L1A#1 L1B#1 = SDE0805A-331K: Fixed Inductors 330uH 10% SMD 0805 AEC-Q200; Isat: 400mA
Q1A#1 Q1B#1 Q2A#1 Q2B#1 Q3A#1 Q3B#1 Q4A#1 Q4B#1 Q5A#1 Q5B#1 Q6A#1 Q6B#1 = CSD19531Q5A: 100V 100A VSONP-8 5.3mOhm Pwr MOSFET; Manufacturer: Texas Instruments; Value2: 48 nC; QgTyp_nC: 48; SizeAreaWB_mm2: 56; SizeArea_mm2: 30; SizeX_mm: 6; SizeY_mm: 5; SizeZ_mm: 1; PartNumber: CSD19531Q5A; Value: 100V; VdsMax_V: 100V; Vgs_V: 100V; IdsMax_A: 100A; RoHS: Y; ComponentLink1Description: Datasheet link
Q7A Q7B = NX7002AKVL: MOSFET 60V 190mA
R1A#1 R1B#1 R2A#1 R2B#1 R3A#1 R3B#1 R4A#1 R4B#1 R5A#1 R5B#1 R6A#1 R6B#1 = ERJ-PA3J4R7V: RES 0402 4.7R 5%
R7A R7B#1 R8A R8B#1 R9A R9B#1 R19A#1 R19B#1 R21A#1 R21B#1 R23A#1 R23B#1 R38A#1 R38B#1 = ERJ-2RKF3902X: RES 0402 39k 1%
R10#1 = ERT-J0EG202GM: NTC THERMISTOR 0402 2k 2%
R10A#1 R10B#1 R11A#1 R11B R12A#1 R12B#1 = WSLF2512L5000FEA: RES 2512 0.5mOhm 1%
R11#1 R12 R13A#1 R13B#1 R14A#1 R14B#1 R15A#1 R15B#1 R20A#1 R20B#1 R22A#1 R22B#1 R24A#1 R24B#1 R39A R39B R40A#1 R40B#1 = ERJ-2RKF2201X: RES 0402 2.2k 1%
R13#1 R16A#1 R16B#1 R17A#1 R17B#1 R18A#1 R18B#1 R34A#1 R34B#1 = ERJ-2RKF1002X: RES 0402 10k 1%
R25A#1 R25B#1 R26A#1 R26B#1 R27A R27B R28A R28B R29A#1 R29B#1 R30A#1 R30B#1 R31A R31B R32A#1 R32B#1 = ERJ-2RKF1000X: RES 0402 100R 1%
R33A#1 = ERJ-2RKF3162X: RES 0402 31.6k 1%
R33B#1 = ERJ-2RKF2611X: RES 0402 2.61k 1%
R35A#1 R35B#1 = ERJ-2RKF2743X: RES 0402 274k 1%
R36A#1 = ERJ-2RKF1333X: RES 0402 133k 1%
R36B#1 = ERJ-2RKF1003X: RES 0402 100k 1%
R37A R37B#1 = ERJ-2RKF4702X: RES 0402 47k 1%
U1A#1 U1B#1 = STM32F405RGT6: Cortex M4 MCU
U3A#1 U3B#1 = DRV8353RH: 100V Three Phase Gate Driver With 3 Current Shunt Amplifiers and Buck Regulator
Y1A#1 Y1B#1 = CSTNE8M00G550000R0: Ceramic Resonator 8.0000MHz 33pf 0.5%

## Sheet TestPanel.SchDoc
size A
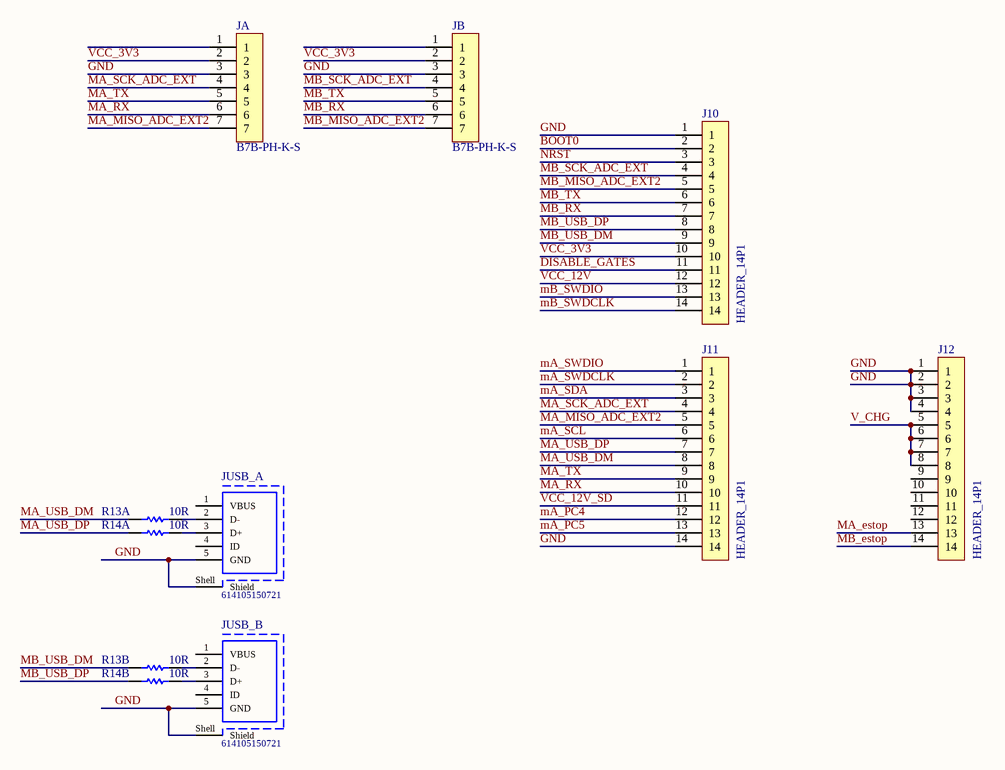
[diagram p2: TestPanel.SchDoc]

### Parts
(Parts that share a designator on the sheet are numbered #1, #2 ... from top to bottom, then left to right.)
J10#2  HEADER_14P1  [HEADER_14P1_FEMALE_TH]
J11#2  HEADER_14P1  [HEADER_14P1_FEMALE_TH]
J12#2  HEADER_14P1  [HEADER_14P1_FEMALE_TH]
JA  B7B-PH-K-S  [B7B-PH-K-S]
JB#2  B7B-PH-K-S  [B7B-PH-K-S]
JUSB_A  614105150721  [614105150721]
JUSB_B  614105150721  [614105150721]
R13A#2  value 10R  [RES 0402]  (hidden comment: ERJ-2RKF10R0X)
R13B#2  value 10R  [RES 0402]  (hidden comment: ERJ-2RKF10R0X)
R14A#2  value 10R  [RES 0402]  (hidden comment: ERJ-2RKF10R0X)
R14B#2  value 10R  [RES 0402]  (hidden comment: ERJ-2RKF10R0X)

### Nets
BOOT0: J10#2.2
DISABLE_GATES: J10#2.11
GND: J10#2.1 J11#2.14 J12#2.1 J12#2.2 J12#2.3 J12#2.4 JA.3 JB#2.3 JUSB_A.5(GND) JUSB_A.Shell(Shield) JUSB_B.5(GND) JUSB_B.Shell(Shield)
mA_eStop: J12#2.13
mA_MISO_ADC_EXT2: J11#2.5 JA.7
mA_PC4: J11#2.12
mA_PC5: J11#2.13
mA_RX: J11#2.10 JA.6
mA_SCK_ADC_EXT: J11#2.4 JA.4
mA_SCL: J11#2.6
mA_SDA: J11#2.3
mA_SWDCLK: J11#2.2
mA_SWDIO: J11#2.1
mA_TX: J11#2.9 JA.5
mA_USB_DM: J11#2.8 R13A#2.1
mA_USB_DP: J11#2.7 R14A#2.1
mB_eStop: J12#2.14
mB_MISO_ADC_EXT2: J10#2.5 JB#2.7
mB_RX: J10#2.7 JB#2.6
mB_SCK_ADC_EXT: J10#2.4 JB#2.4
mB_SWDCLK: J10#2.14
mB_SWDIO: J10#2.13
mB_TX: J10#2.6 JB#2.5
mB_USB_DM: J10#2.9 R13B#2.1
mB_USB_DP: J10#2.8 R14B#2.1
NRST: J10#2.3
V_CHG: J12#2.5 J12#2.6 J12#2.7 J12#2.8
VCC_3V3: J10#2.10 JA.2 JB#2.2
VCC_12V: J10#2.12
VCC_12V_SD: J11#2.11
NetJUSB_A_2: JUSB_A.2(D-) R13A#2.2
NetJUSB_A_3: JUSB_A.3(D+) R14A#2.2
NetJUSB_B_2: JUSB_B.2(D-) R13B#2.2
NetJUSB_B_3: JUSB_B.3(D+) R14B#2.2

Not connected (* = marked no-connect by the designer): J12#2 9 10 11 12; JA 1; JB#2 1; JUSB_A 1(VBUS) 4(ID); JUSB_B 1(VBUS) 4(ID)

### Library data of the parts
J10#2 J11#2 J12#2 = HEADER_14P1: 2.54mm Header 14 Pin 1 Row
JA JB#2 = B7B-PH-K-S: 2mm JST SOCKET 7 Pin
JUSB_A JUSB_B = 614105150721: Micro USB 2.0 Type B Receptacle WR-COM, Vertical, THT; Rated Current: 1.8 A; Contact Resistance: 30 mOhm; Working Voltage: 30 VAC; ComponentLink1Description: Manufacturer; ComponentLink1URL: http://www.we-online.de; ComponentLink2Description: Datasheet; ComponentLink2URL: https://katalog.we-online.de/em/datasheet/614105150721.pdf; Part Number: 614105150721; Published Date: September 2018; Publisher: Wurth Elektronik; Orientation: Vertical; Connector Type: Micro USB 2.0 Type B; Operating Temperature: -40 to 85 degC; Mounting Technology: THT; Gender: Receptacle; Packaging: Tape and Reel
R13A#2 R13B#2 R14A#2 R14B#2 = ERJ-2RKF10R0X: RES 0402 10R 1%